# Altium schematic sheet FP_Connectors.SchDoc: =DocumentName
size A4; DocumentNumber: 1; Revision: 0; SheetNumber: 5; SheetTotal: 19; Last modified by: Krzysztof Belewicz
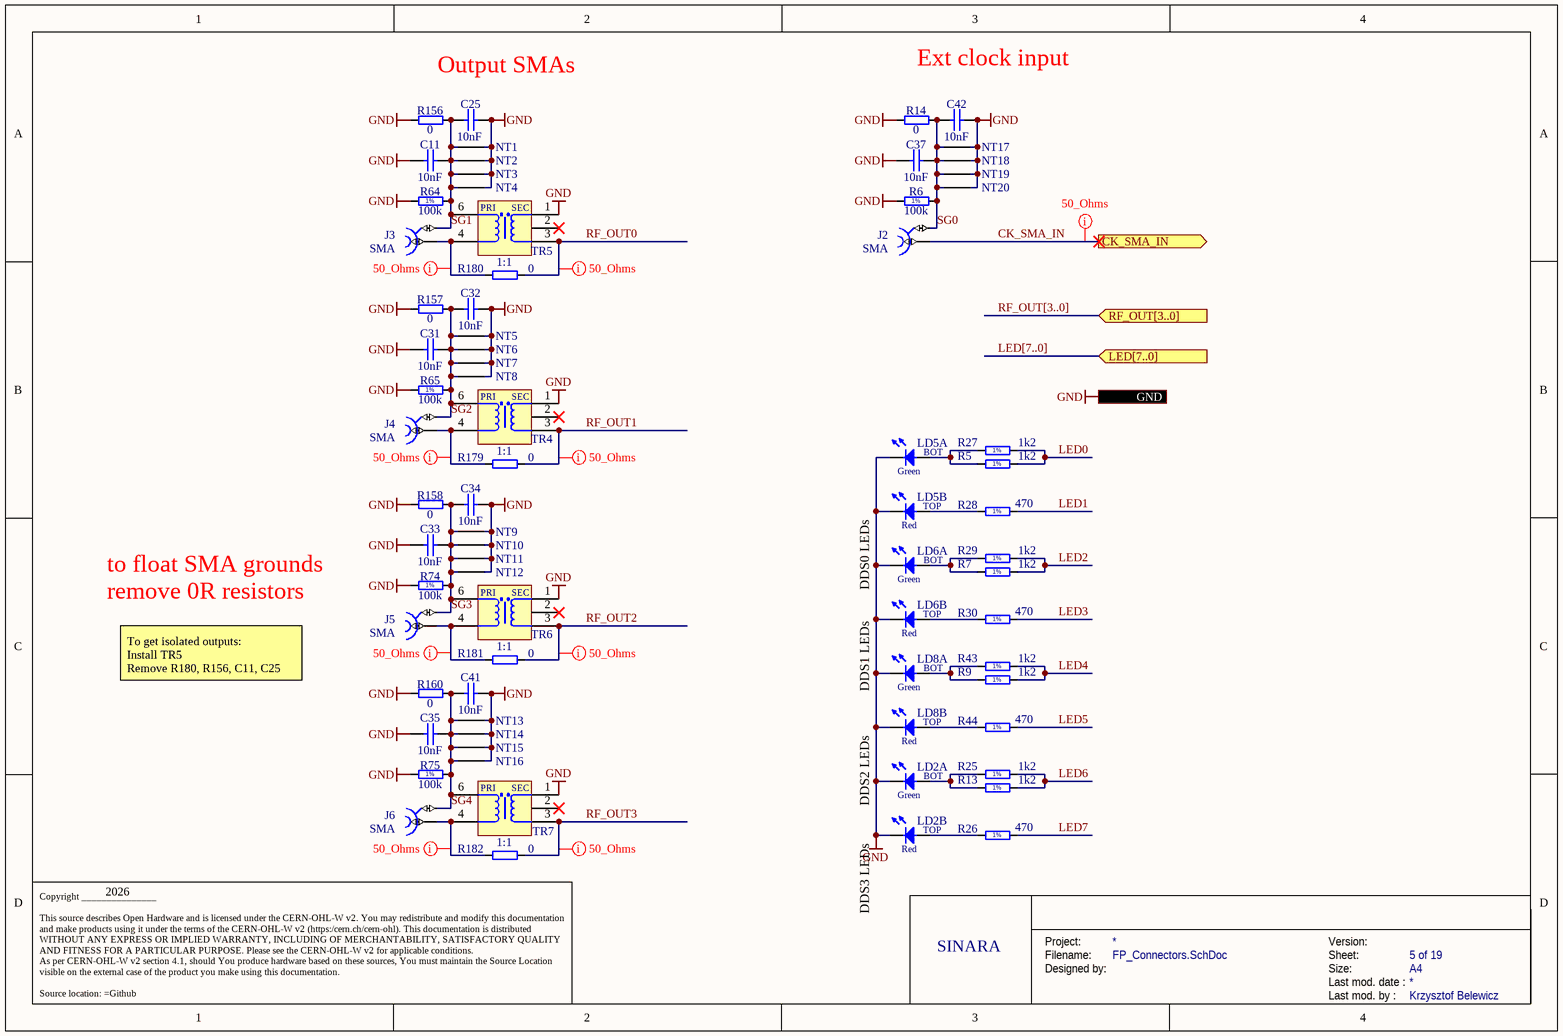
[diagram p0: FP_Connectors.SchDoc]

## Parts
C11  10nF  [CAPC1005X55N]
C25  10nF  [CAPC1005X55N]
C31  10nF  [CAPC1005X55N]
C32  10nF  [CAPC1005X55N]
C33  10nF  [CAPC1005X55N]
C34  10nF  [CAPC1005X55N]
C35  10nF  [CAPC1005X55N]
C37  10nF  [CAPC1005X55N]
C41  10nF  [CAPC1005X55N]
C42  10nF  [CAPC1005X55N]
J2  SMA  [DELOCK_65848]
J3  SMA  [DELOCK_65848]
J4  SMA  [DELOCK_65848]
J5  SMA  [DELOCK_65848]
J6  SMA  [DELOCK_65848]
LD2  Red/Green  [LED_DIALIGHT_571-0112F]  (value not drawn)  (parts A,B of 2)
LD5  Red/Green  [LED_DIALIGHT_571-0112F]  (value not drawn)  (parts A,B of 2)
LD6  Red/Green  [LED_DIALIGHT_571-0112F]  (value not drawn)  (parts A,B of 2)
LD8  Red/Green  [LED_DIALIGHT_571-0112F]  (value not drawn)  (parts A,B of 2)
NT1  Net Tie  [Net Tie]  (value not drawn)  (net tie, no BOM)
NT2  Net Tie  [Net Tie]  (value not drawn)  (net tie, no BOM)
NT3  Net Tie  [Net Tie]  (value not drawn)  (net tie, no BOM)
NT4  Net Tie  [Net Tie]  (value not drawn)  (net tie, no BOM)
NT5  Net Tie  [Net Tie]  (value not drawn)  (net tie, no BOM)
NT6  Net Tie  [Net Tie]  (value not drawn)  (net tie, no BOM)
NT7  Net Tie  [Net Tie]  (value not drawn)  (net tie, no BOM)
NT8  Net Tie  [Net Tie]  (value not drawn)  (net tie, no BOM)
NT9  Net Tie  [Net Tie]  (value not drawn)  (net tie, no BOM)
NT10  Net Tie  [Net Tie]  (value not drawn)  (net tie, no BOM)
NT11  Net Tie  [Net Tie]  (value not drawn)  (net tie, no BOM)
NT12  Net Tie  [Net Tie]  (value not drawn)  (net tie, no BOM)
NT13  Net Tie  [Net Tie]  (value not drawn)  (net tie, no BOM)
NT14  Net Tie  [Net Tie]  (value not drawn)  (net tie, no BOM)
NT15  Net Tie  [Net Tie]  (value not drawn)  (net tie, no BOM)
NT16  Net Tie  [Net Tie]  (value not drawn)  (net tie, no BOM)
NT17  Net Tie  [Net Tie]  (value not drawn)  (net tie, no BOM)
NT18  Net Tie  [Net Tie]  (value not drawn)  (net tie, no BOM)
NT19  Net Tie  [Net Tie]  (value not drawn)  (net tie, no BOM)
NT20  Net Tie  [Net Tie]  (value not drawn)  (net tie, no BOM)
R5  1k2  [RESC1608X55N]
R6  100k  [RESC1005X40N]
R7  1k2  [RESC1608X55N]
R9  1k2  [RESC1608X55N]
R13  1k2  [RESC1608X55N]
R14  0  [RESC1608X55N]
R25  1k2  [RESC1608X55N]
R26  470  [RESC1005X40N]
R27  1k2  [RESC1608X55N]
R28  470  [RESC1005X40N]
R29  1k2  [RESC1608X55N]
R30  470  [RESC1005X40N]
R43  1k2  [RESC1608X55N]
R44  470  [RESC1005X40N]
R64  100k  [RESC1005X40N]
R65  100k  [RESC1005X40N]
R74  100k  [RESC1005X40N]
R75  100k  [RESC1005X40N]
R156  0  [RESC1608X55N]
R157  0  [RESC1608X55N]
R158  0  [RESC1608X55N]
R160  0  [RESC1608X55N]
R179  0  [RESC1005X40N]
R180  0  [RESC1005X40N]
R181  0  [RESC1005X40N]
R182  0  [RESC1005X40N]
TR4  1:1  [XFMR_MINI-CIRCUITS_AT224-1]
TR5  1:1  [XFMR_MINI-CIRCUITS_AT224-1]
TR6  1:1  [XFMR_MINI-CIRCUITS_AT224-1]
TR7  1:1  [XFMR_MINI-CIRCUITS_AT224-1]

## Ports
CK_SMA_IN (out), GND, LED[7..0] (in), RF_OUT[3..0] (in)

## Nets
GND: C11.2 C25.1 C31.2 C32.1 C33.2 C34.1 C35.2 C37.2 C41.1 C42.1 LD2.1(C) LD2.3(C) LD5.1(C) LD5.3(C) LD6.1(C) LD6.3(C) LD8.1(C) LD8.3(C) NT1.2 NT2.2 NT3.2 NT4.2 NT5.2 NT6.2 NT7.2 NT8.2 NT9.2 NT10.2 NT11.2 NT12.2 NT13.2 NT14.2 NT15.2 NT16.2 NT17.2 NT18.2 NT19.2 NT20.2 R6.1 R14.1 R64.1 R65.1 R74.1 R75.1 R156.1 R157.1 R158.1 R160.1 TR4.1(SDOT) TR5.1(SDOT) TR6.1(SDOT) TR7.1(SDOT) ; port GND
CK_SMA_IN: J2.1 ; port CK_SMA_IN
LED0: R5.2 R27.2
LED1: R28.1
LED2: R7.2 R29.2
LED3: R30.1
LED4: R9.2 R43.2
LED5: R44.1
LED6: R13.2 R25.2
LED7: R26.1
RF_OUT0: R180.2 TR5.3(S)
RF_OUT1: R179.2 TR4.3(S)
RF_OUT2: R181.2 TR6.3(S)
RF_OUT3: R182.2 TR7.3(S)
SG0: C37.1 C42.2 J2.2 NT17.1 NT18.1 NT19.1 NT20.1 R6.2 R14.2
SG1: C11.1 C25.2 J3.2 NT1.1 NT2.1 NT3.1 NT4.1 R64.2 R156.2 TR5.6(PDOT)
SG2: C31.1 C32.2 J4.2 NT5.1 NT6.1 NT7.1 NT8.1 R65.2 R157.2 TR4.6(PDOT)
SG3: C33.1 C34.2 J5.2 NT9.1 NT10.1 NT11.1 NT12.1 R74.2 R158.2 TR6.6(PDOT)
SG4: C35.1 C41.2 J6.2 NT13.1 NT14.1 NT15.1 NT16.1 R75.2 R160.2 TR7.6(PDOT)
NetJ3_1: J3.1 R180.1 TR5.4(P)
NetJ4_1: J4.1 R179.1 TR4.4(P)
NetJ5_1: J5.1 R181.1 TR6.4(P)
NetJ6_1: J6.1 R182.1 TR7.4(P)
NetLD2_2: LD2.2(A) R13.1 R25.1
NetLD2_4: LD2.4(A) R26.2
NetLD5_2: LD5.2(A) R5.1 R27.1
NetLD5_4: LD5.4(A) R28.2
NetLD6_2: LD6.2(A) R7.1 R29.1
NetLD6_4: LD6.4(A) R30.2
NetLD8_2: LD8.2(A) R9.1 R43.1
NetLD8_4: LD8.4(A) R44.2

Not connected (* = marked no-connect by the designer): TR4 2(NU)*; TR5 2(NU)*; TR6 2(NU)*; TR7 2(NU)*

## Buses and harness runs
bus LED[7..0] = port LED[7..0]
bus RF_OUT[3..0] = port RF_OUT[3..0]

## Layout directives
net class 50_Ohms: CK_SMA_IN, NetJ3_1, NetJ4_1, NetJ5_1, NetJ6_1, RF_OUT0, RF_OUT1, RF_OUT2, RF_OUT3

## Notes on the sheet
- Output SMAs
- Ext clock input
- (near LD5) DDS0 LEDs
- to float SMA grounds
- remove 0R resistors
- (near LD6) DDS1 LEDs
- To get isolated outputs:
  Install TR5
  Remove R180, R156, C11, C25
- (near LD8) DDS2 LEDs
- (near LD2) DDS3 LEDs
- 2026
- SINARA
- Project:
- Designed by:
- Filename:
- Size:
- Version:
- Last mod. date :
- Sheet:
- A4
- Copyright _______________
  This source describes Open Hardware and is licensed under the CERN-OHL-W v2. You may redistribute and modify this documentation and make products using it under the terms of the CERN-OHL-W v2 (https:/cern.ch/cern-ohl). This documentation is distributed WITHOUT ANY EXPRESS OR IMPLIED WARRANTY, INCLUDING OF MERCHANTABILITY, SATISFACTORY QUALITY AND FITNESS FOR A PARTICULAR PURPOSE. Please see the CERN-OHL-W v2 for applicable conditions.
  As per CERN-OHL-W v2 section 4.1, should You produce hardware based on these sources, You must maintain the Source Location visible on the external case of the product you make using this documentation.
  Source location: =Github
- Last mod. by :
- (in symbol LED_DIALIGHT_571-0112F, part A) BOT; Green
- (in symbol LED_DIALIGHT_571-0112F, part B) TOP; Red
- (in symbol R0402_100K_1%_0.0625W_100PPM) 1%
- (in symbol R0402_470R_1%_0.0625W_100PPM) 1%
- (in symbol R0603_1K2_1%_0.1W_100PPM) 1%
- (in symbol XFMR_MINI-CIRCUITS_TC1-1+) PRI; SEC

## Library data of the parts
C11 C25 C31-C35 C37 C41 C42 = CC0402_10NF_16V_10%_X7R: Non-polarised capacitor; Part Description: SMD Multilayer Chip Ceramic Capacitor; Manufacturer: GENERIC; Manufacturer1 Part Number: 223878715636; Voltage: 16V; TC: X7R; Tolerance: ±10%; Part Number: CC0402_10NF_16V_10%_X7R; Component Kind: Standard; Component Type: Standard; Pin Count: 2; Value: 10nF; Status: Not Recommended; Manufacturer Part Number: CC0402_10NF_16V_10%_X7R; Case: 0402; Mounted: Yes; Socket: No; SMD: Yes; Sense: No; Manufacturer1 Example: PHYCOMP; Manufacturer1 ComponentHeight: 0.55mm; HelpURL: \\cern.ch\dfs\Applications\Altium\Datasheets\CC0402_X7R_PHYCOMP.pdf; Author: CERN DEM JLC; CreateDate: 2007-12-03; LatestRevisionDate: 2007-12-03
J2-J6 = DELOCK_65848: 50 Ohm Through Hole SMA Right Angle PCB Jack; Manufacturer: DELOCK; Manufacturer Part Number: 5848 (4043619658480); PressFit: No; Part Number: DELOCK_65848; Component Kind: Standard; Component Type: Standard; Pin Count: 5; Family: SMA; Mounted: Yes; Socket: No; SMD: No; Sense: No; Status: None; Part Description: 50 Ohm Through Hole SMA Right Angle PCB Jack; ComponentHeight: 12.5; HelpURL: \\cern.ch\dfs\Applications\Altium\Datasheets\AMPHENOL_132203-16.pdf; Author: GK; CreateDate: 13.05.2019; LatestRevisionDate: 13.05.2019
LD2 LD5 LD6 LD8 = LED_DIALIGHT_571-0112F: 2x LED  Botom Green, Top Red; Part Description: Dual 2mm  LEDs, Red Top,Green Bot, CBI® Circuit Board Indicator (Without positioning pins); PressFit: No; Bonding: No; Part Number: LED_DIALIGHT_571-0112F; Component Kind: Standard; Component Type: Standard; Color: Red/Green; PackageDescription: 2x 2mm LED (Top: Red, Bot: Green) PCB Edge Mounting (Without positioning pins) DIALIGHT 571 Serie; Manufacturer: DIALIGHT; Manufacturer Part Number: 571-0112F; Pin Count: 4; Mounted: Yes; Socket: No; SMD: No; Sense: No; ComponentHeight: 8.6mm; HelpURL: \\cern.ch\dfs\Applications\Altium\Datasheets\LED_DIALIGHT_571-0112F.pdf; Author: CERN DEM JLC; CreateDate: 09.11.2009; LatestRevisionDate: 17.03.2010
NT1-NT20 = Net Tie: Part Description: Net Tie (2 Nets); Mounted: No; Part Number: Net Tie; Component Type: Net Tie; Pin Count: 2; Family: Net Tie; Socket: No; SMD: No; Sense: No; Status: None; ComponentHeight: 0mm; HelpURL: Undefined; Author: CERN DEM JLC; CreateDate: 22.03.2011; LatestRevisionDate: 22.03.2011; PackageDescription: 2 Plated Through Hole For Coaxial Cable Link: Hole Dia.=1.4mm Pad Dia.=2.5mm
R5 R7 R9 R13 R25 R27 R29 R43 = R0603_1K2_1%_0.1W_100PPM: Resistor - 1%; Part Description: General Purpose Thick Film Chip Resistor; Manufacturer: GENERIC; Manufacturer1 Part Number: NRC06F1201TRF; Power: 0.1W; TC: ±100ppm/°C; Part Number: R0603_1K2_1%_0.1W_100PPM; Component Kind: Standard; Component Type: Standard; Pin Count: 2; Value: 1k2; Status: Preferred; Tolerance: ±1%; Manufacturer Part Number: R0603_1K2_1%_0.1W_100PPM; Case: 0603; Mounted: Yes; Sense: No; Socket: No; SMD: Yes; Manufacturer1 Example: NIC COMPONENT; Manufacturer1 ComponentHeight: 0.55mm; HelpURL: \\cern.ch\dfs\Applications\Altium\Datasheets\R0603_NIC_NRC.pdf; Author: CERN DEM JLC; CreateDate: 03.12.2007; LatestRevisionDate: 13.03.2008
R6 R64 R65 R74 R75 = R0402_100K_1%_0.0625W_100PPM: Resistor - 1%; Part Description: General Purpose Thick Film Chip Resistor; Manufacturer: GENERIC; Manufacturer1 Part Number: 232270671004L; PressFit: No; TC: ±100ppm/°C; Part Number: R0402_100K_1%_0.0625W_100PPM; Component Kind: Standard; Component Type: Standard; Pin Count: 2; Value: 100k; Status: Not Recommended; Manufacturer Part Number: R0402_100K_1%_0.0625W_100PPM; Case: 0402; Mounted: Yes; Sense: No; Socket: No; SMD: Yes; Manufacturer1 Example: YAGEO PHYCOMP; Manufacturer1 ComponentHeight: 0.4mm; HelpURL: \\cern.ch\dfs\Applications\Altium\Datasheets\R0402_Phycomp_RC0402.pdf; Author: CERN DEM JLC; CreateDate: 03.12.2007; LatestRevisionDate: 17.10.2012; Power: 0.0625W; Tolerance: ±1%
R14 R156-R158 R160 = R0603_0R_JUMPER: Resistor; Part Description: 1A (0.05R Max DC Resistance) Zero Ohm Jumper; Manufacturer: GENERIC; Manufacturer1 Part Number: NRC06Z0; PressFit: No; Part Number: R0603_0R_JUMPER; Component Kind: Standard; Component Type: Standard; Pin Count: 2; Value: 0; Status: Preferred; Manufacturer Part Number: R0603_0R_JUMPER; Case: 0603; Mounted: Yes; Sense: No; Socket: No; SMD: Yes; Manufacturer1 Example: NIC COMPONENT; Manufacturer1 ComponentHeight: 0.55mm; HelpURL: \\cern.ch\dfs\Applications\Altium\Datasheets\R0603_NIC_NRC.pdf; Author: CERN DEM JLC; CreateDate: 03.12.2007; LatestRevisionDate: 13.03.2008
R26 R28 R30 R44 = R0402_470R_1%_0.0625W_100PPM: Resistor - 1%; Part Description: General Purpose Thick Film Chip Resistor; Manufacturer: GENERIC; Manufacturer1 Part Number: 232270674701L; TC: ±100ppm/°C; PressFit: No; Part Number: R0402_470R_1%_0.0625W_100PPM; Component Kind: Standard; Component Type: Standard; Pin Count: 2; Value: 470; Status: Not Recommended; Power: 0.0625W; Tolerance: ±1%; Manufacturer Part Number: R0402_470R_1%_0.0625W_100PPM; Case: 0402; Mounted: Yes; Sense: No; Socket: No; SMD: Yes; Manufacturer1 Example: YAGEO PHYCOMP; Manufacturer1 ComponentHeight: 0.4mm; HelpURL: \\cern.ch\dfs\Applications\Altium\Datasheets\R0402_Phycomp_RC0402.pdf; Author: CERN DEM JLC; CreateDate: 03.12.2007; LatestRevisionDate: 17.10.2012
R179-R182 = R0402_0R_JUMPER: Resistor; Part Description: 1A (0.05R Max DC Resistance) Zero Ohm Jumper; Manufacturer: GENERIC; Manufacturer1 Part Number: 232270591001L; Part Number: R0402_0R_JUMPER; Component Kind: Standard; Component Type: Standard; Pin Count: 2; Value: 0; Status: Not recommended; Manufacturer Part Number: R0402_0R_JUMPER; Case: 0402; Mounted: Yes; Sense: No; Socket: No; SMD: Yes; Manufacturer1 Example: YAGEO PHYCOMP; Manufacturer1 ComponentHeight: 0.4mm; HelpURL: \\cern.ch\dfs\Applications\Altium\Datasheets\R0402_Phycomp_RC0402.pdf; Author: CERN DEM JLC; CreateDate: 2007-12-03; LatestRevisionDate: 2012-10-17
TR4-TR7 = XFMR_MINI-CIRCUITS_TC1-1+: 50 Ohm 1.5 To 500MHz RF Transformers; Part Description: 50 Ohms 1.5 to 500 MHz RF Transformer; Manufacturer Part Number: TC1-1+; Part Number: XFMR_MINI-CIRCUITS_TC1-1+; Component Kind: Standard; Component Type: Standard; Pin Count: 5; Value: 1:1; Status: None; Manufacturer: MINI-CIRCUITS; Mounted: Yes; Socket: No; Sense: No; SMD: Yes; ComponentHeight: 4.06mm; HelpURL: \\cern.ch\dfs\Applications\Altium\Datasheets\XFMR_MINI-CIRCUITS_TC1-1+.pdf; Author: CERN DEM JLC; CreateDate: 08/02/2010; LatestRevisionDate: 27/04/2010